# Altium schematic sheet Input.SchDoc
size 297 x 209 mm; SheetNumber: 4; SheetTotal: 4
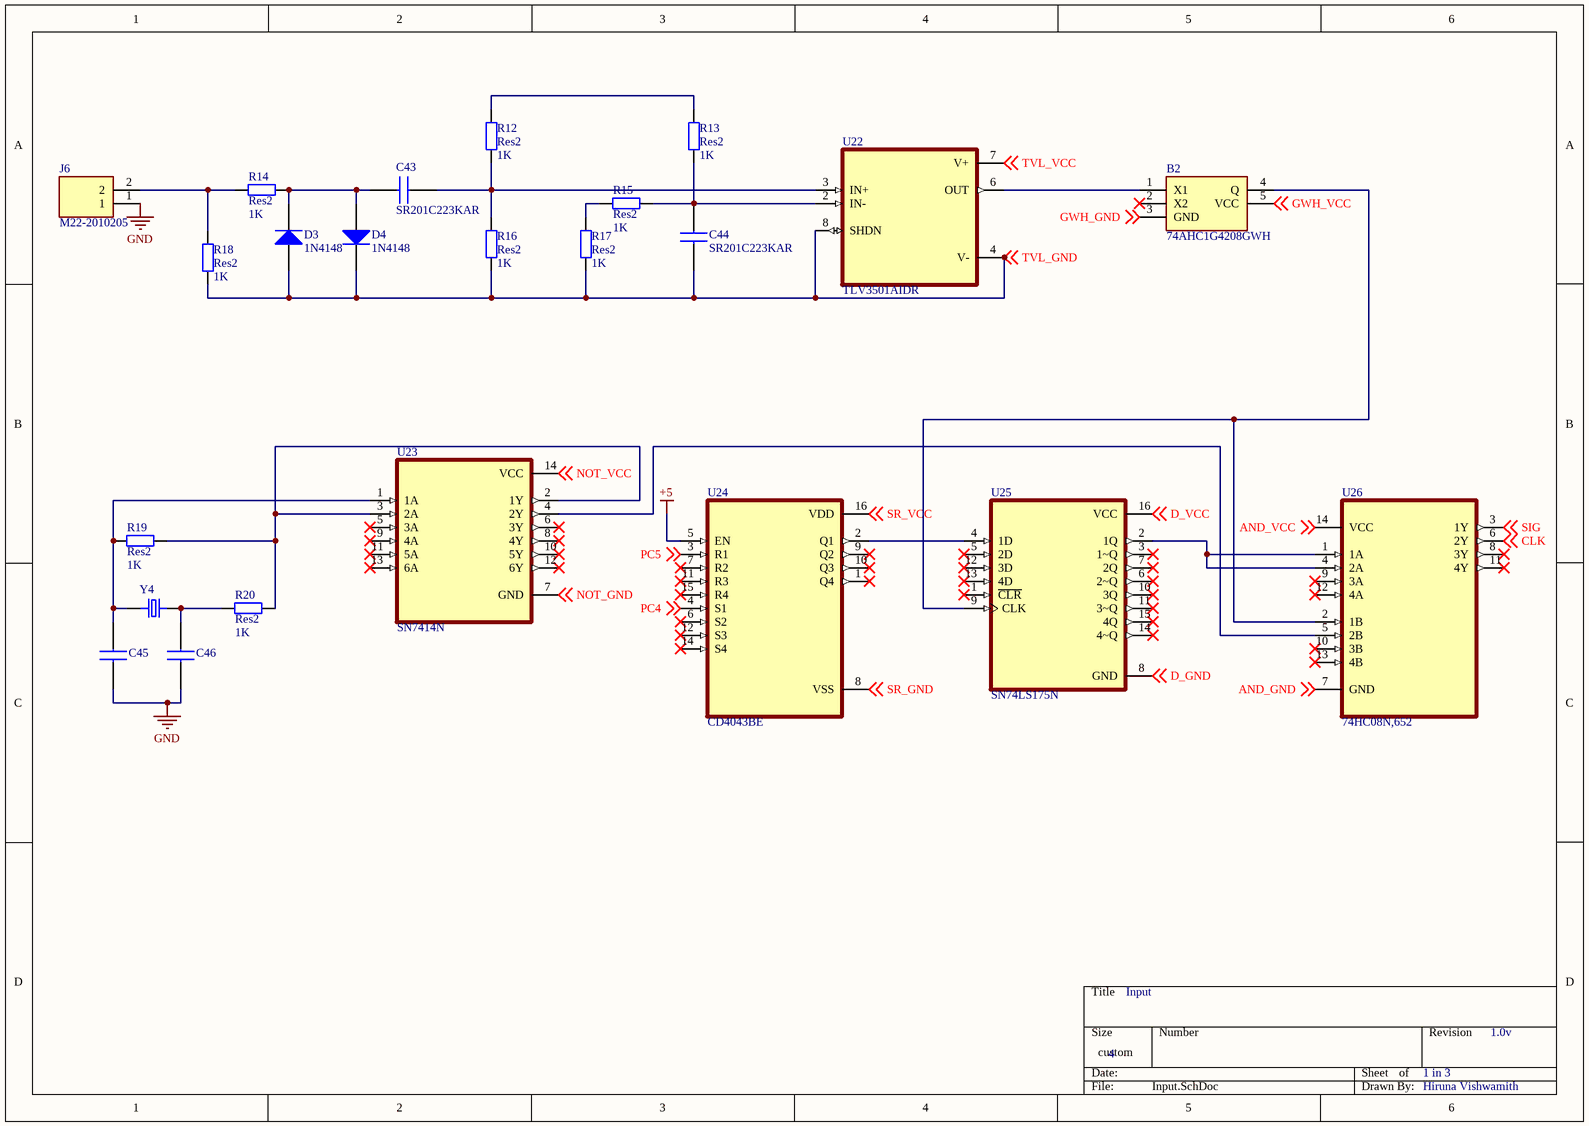
[diagram p0: Input.SchDoc]

## Parts
B2  74AHC1G4208GWH  [SOT65P212X110-5N]
C43  SR201C223KAR  [AVX-SR20]
C44  SR201C223KAR  [AVX-SR20]
C45  SR201C223KAR  [AVX-SR20]  (value not drawn)
C46  SR201C223KAR  [AVX-SR20]  (value not drawn)
D3  1N4148  [NXP-SOD27-2_V]
D4  1N4148  [NXP-SOD27-2_V]
J6  M22-2010205  [HDRV2W50P0X200_1X2_400X200X525P]
R12  Res2  value 1K  [AXIAL-0.4]
R13  Res2  value 1K  [AXIAL-0.4]
R14  Res2  value 1K  [AXIAL-0.4]
R15  Res2  value 1K  [AXIAL-0.4]
R16  Res2  value 1K  [AXIAL-0.4]
R17  Res2  value 1K  [AXIAL-0.4]
R18  Res2  value 1K  [AXIAL-0.4]
R19  Res2  value 1K  [AXIAL-0.4]
R20  Res2  value 1K  [AXIAL-0.4]
U22  TLV3501AIDR  [SOIC127P599X175-8N]
U23  SN7414N  [DIP794W45P254L1969H508Q14]
U24  CD4043BE  [DIP794W45P254L1969H508Q16]
U25  SN74LS175N  [DIP794W45P254L1969H508Q16]
U26  74HC08N,652  [DIP254P762X420-14]
Y4  ECS-240.0001-18-1X  [XTAL_ECS-200-20-1X]  (value not drawn)

## Nets
+5: U24.5(EN)
GND: C45.1 C46.1 J6.1
AND_GND: U26.7(GND) ; off-sheet AND_GND
AND_VCC: U26.14(VCC) ; off-sheet AND_VCC
CLK: U26.6(2Y) ; off-sheet CLK
D_GND: U25.8(GND) ; off-sheet D_GND
D_VCC: U25.16(VCC) ; off-sheet D_VCC
GWH_GND: B2.3(GND) ; off-sheet GWH_GND
GWH_VCC: B2.5(VCC) ; off-sheet GWH_VCC
NOT_GND: U23.7(GND) ; off-sheet NOT_GND
NOT_VCC: U23.14(VCC) ; off-sheet NOT_VCC
PC4: U24.4(S1) ; off-sheet PC4
PC5: U24.3(R1) ; off-sheet PC5
SIG: U26.3(1Y) ; off-sheet SIG
SR_GND: U24.8(VSS) ; off-sheet SR_GND
SR_VCC: U24.16(VDD) ; off-sheet SR_VCC
TVL_GND: C44.2 D3.1(A) D4.2(K) R16.2 R17.2 R18.2 U22.4(V-) U22.8(SHDN) ; off-sheet TVL_GND
TVL_VCC: U22.7(V+) ; off-sheet TVL_VCC
NetB2_1: B2.1(X1) U22.6(OUT)
NetB2_4: B2.4(Q) U25.9(CLK) U26.2(1B)
NetC43_1: C43.1 R12.2 R16.1 U22.3(IN+)
NetC43_2: C43.2 D3.2(K) D4.1(A) R14.1
NetC44_1: C44.1 R13.2 R15.1 U22.2(IN-)
NetC45_2: C45.2 R19.2 U23.1(1A) Y4.1
NetC46_2: C46.2 R20.2 Y4.2
NetJ6_2: J6.2 R14.2 R18.1
NetR12_1: R12.1 R13.1
NetR15_2: R15.2 R17.1
NetR19_1: R19.1 R20.1 U23.2(1Y) U23.3(2A)
NetU23_4: U23.4(2Y) U26.5(2B)
NetU24_2: U24.2(Q1) U25.4(1D)
NetU25_2: U25.2(1Q) U26.1(1A) U26.4(2A)

Not connected (* = marked no-connect by the designer): B2 2(X2)*; U23 5(3A)* 6(3Y)* 8(4Y)* 9(4A)* 10(5Y)* 11(5A)* 12(6Y)* 13(6A)*; U24 1(Q4)* 6(S2)* 7(R2)* 9(Q2)* 10(Q3)* 11(R3)* 12(S3)* 14(S4)* 15(R4)*; U25 1(~{CLR})* 3(1~Q)* 5(2D)* 6(2~Q)* 7(2Q)* 10(3Q)* 11(3~Q)* 12(3D)* 13(4D)* 14(4~Q)* 15(4Q)*; U26 8(3Y)* 9(3A)* 10(3B)* 11(4Y)* 12(4A)* 13(4B)*

## Notes on the sheet
- Input
- 4
- 1 in 3
- 1.0v
- Hiruna Vishwamith

## Library data of the parts
B2 = 74AHC1G4208GWH: vp_74AHC1G4208.ditamap - 8-stage divider and oscillator@en-us; Manufacturer_Name: Nexperia; Geometry.Height: 1.1mm; Manufacturer_Part_Number: 74AHC1G4208GWH; Mouser Part Number: 771-74AHC1G4208GWH; Mouser Price/Stock: https://www.mouser.co.uk/ProductDetail/Nexperia/74AHC1G4208GWH?qs=17u8i%2FzlE8%2FxKrIMt8zS2A%3D%3D; Arrow Part Number: 74AHC1G4208GWH; Arrow Price/Stock: https://www.arrow.com/en/products/74ahc1g4208gwh/nexperia?region=nac; Datasheet Link: https://assets.nexperia.com/documents/data-sheet/74AHC1G4208.pdf
C43-C46 = SR201C223KAR: Cap Ceramic 0.022uF 100V X7R 10% Radial 2.54mm 125C Bulk; Manufacturer_Name: AVX; Manufacturer_Part_Number: SR201C223KAR; Mouser Part Number: *; Mouser Price/Stock: *; Arrow Part Number: SR201C223KAR; Arrow Price/Stock: https://www.arrow.com/en/products/sr201c223kar/avx; Datasheet Link: http://datasheets.avx.com/SR-Series.pdf
D3 D4 = CMP-004-00000-2: High Speed Diode, 100 V, 0.45 A, -65 to 175 degC, 2-Pin SOD27, RoHS, Bulk; Manufacturer: Fairchild; Elements: 1; Recovery Time: 4ns; Forward Current: 300mA; Power: 500mW; Forward Voltage: 1V; Max Surge Current: 4A; Peak Reverse Current: 5uA; Datasheet URL: http://www.nxp.com/documents/data_sheet/1N4148_1N4448.pdf; Min Operating Temperature: -65°C; Manufacturer URL: https://www.fairchildsemi.com/; Packaging: Bulk; Diameter: 1.91mm; Pins: 2; Package URL: http://www.nxp.com/documents/data_sheet/1N4148_1N4448.pdf; Package Reference: SOD27; Max Operating Temperature: 175°C; Package Quantity: 2000; Case/Package: DO; Datasheet Version: Aug-04; RoHS Compliant: True
J6 = M22-2010205: Header, SIL, vertical, 2 way, 2mm pitch HARWIN M22-20 Series, 2mm Pitch 2 Way 1 Row Straight PCB Header, Solder Termination, 1A; Geometry.Height: 5.25mm; Manufacturer_Name: Harwin; Manufacturer_Part_Number: M22-2010205; Mouser Part Number: 855-M22-2010205; Mouser Price/Stock: https://www.mouser.co.uk/ProductDetail/Harwin/M22-2010205?qs=xxdqPuaJ%252Ba2I8VeWvpQIzQ%3D%3D; Arrow Part Number: *; Arrow Price/Stock: *; Datasheet Link: http://uk.rs-online.com/web/p/products/6813287
R12-R20 = Res2: Resistor; Published: 8-Jun-2000; LatestRevisionDate: 17-Jul-2002; LatestRevisionNote: Re-released for DXP Platform.; PackageReference: AXIAL-0.4; Publisher: Altium Limited; PackageDescription: Axial Device, Thru-Hole; 2 Leads; 0.4 in Pin Spacing
U22 = TLV3501AIDR: 4.5ns, Rail-to-Rail, High Speed Comparator with Shutdown 8-SOIC -40 to 125; MF: Texas Instruments; MP: TLV3501AIDR; Purchase-URL: https://pricing.snapeda.com/search/part/TLV3501AIDR/?ref=eda; Package: SOIC-8 Texas Instruments; Value: *; Digi-Key_Part_Number: 296-43611-1-ND; Check_prices: https://www.snapeda.com/parts/TLV3501AIDR/Texas+Instruments/view-part/?ref=eda; SnapEDA_Link: https://www.snapeda.com/parts/TLV3501AIDR/Texas+Instruments/view-part/?ref=snap
U23 = SN7414N: Hex schmitt-trigger inverters 14-PDIP 0 to 70; MF: Texas Instruments; Price: None; MP: SN7414N; DigiKey-Purchase-URL: https://snapeda.com/shop?store=DigiKey&id=51455; Value: *; Package: PDIP-14 Texas Instruments; Mouser-Purchase-URL: https://snapeda.com/shop?store=Mouser&id=51455; SnapEDA_Link: https://www.snapeda.com/parts/SN7414N/Texas%20Instruments/view-part/51455/?ref=snap; Availability: Warning; Texas_Instruments-Purchase-URL: https://snapeda.com/shop?store=Texas+Instruments&id=51455; Check_prices: https://www.snapeda.com/parts/SN7414N/Texas%20Instruments/view-part/51455/?ref=eda
U24 = CD4043BE: CMOS Quad NOR R/S Latch with 3-State Outputs 16-PDIP -55 to 125; MF: Texas Instruments; Value: *; Arrow_Electronics-Purchase-URL: https://snapeda.com/shop?store=Arrow+Electronics&id=577167; Package: PDIP-16 Texas Instruments; DigiKey-Purchase-URL: https://snapeda.com/shop?store=DigiKey&id=577167; Mouser-Purchase-URL: https://snapeda.com/shop?store=Mouser&id=577167; Price: None; MP: CD4043BE; Availability: Good; SnapEDA_Link: https://www.snapeda.com/parts/CD4043BE/Texas%20Instruments/view-part/577167/?ref=snap; Texas_Instruments-Purchase-URL: https://snapeda.com/shop?store=Texas+Instruments&id=577167; BuyPart: https://www.snapeda.com/parts/CD4043BE/Texas%20Instruments/view-part/577167/?ref=eda
U25 = SN74LS175N: Quadruple D-Type Flip-Flops With Clear 16-PDIP 0 to 70; MF: Texas Instruments; MP: SN74LS175N; SnapEDA_Link: https://www.snapeda.com/parts/SN74LS175N/Texas%20Instruments/view-part/572262/?ref=snap; Package: PDIP-16 Texas Instruments; Value: *; Check_prices: https://www.snapeda.com/parts/SN74LS175N/Texas%20Instruments/view-part/572262/?ref=eda; Purchase-URL: https://pricing.snapeda.com/search/part/SN74LS175N/?ref=eda; Digi-Key_Part_Number: 296-28719-2-ND
U26 = 74HC08N,652: AND Gate IC 4 Channel 14-DIP; MF: NXP USA; Availability: Warning; MP: 74HC08N,652; DigiKey-Purchase-URL: https://snapeda.com/shop?store=DigiKey&id=41634; Value: *; SnapEDA_Link: https://www.snapeda.com/parts/74HC08N,652/NXP%20USA%20Inc./view-part/41634/?ref=snap; Price: None; Package: DIP-14 NXP Semiconductors; BuyPart: https://www.snapeda.com/parts/74HC08N,652/NXP%20USA%20Inc./view-part/41634/?ref=eda
Y4 = ECS-240.0001-18-1X: Crystals / Oscillators / Resonators 24.00014MHz 18pF; MF: ECS International; Package: HC49/U ECS International; Availability: Unavailable; Value: *; MP: ECS-240.0001-18-1X; Price: None; SnapEDA_Link: https://www.snapeda.com/parts/ECS-240.0001-18-1X/ECS%20International/view-part/259232/?ref=snap